# Altium schematic sheet YLT1.SchDoc
size A4
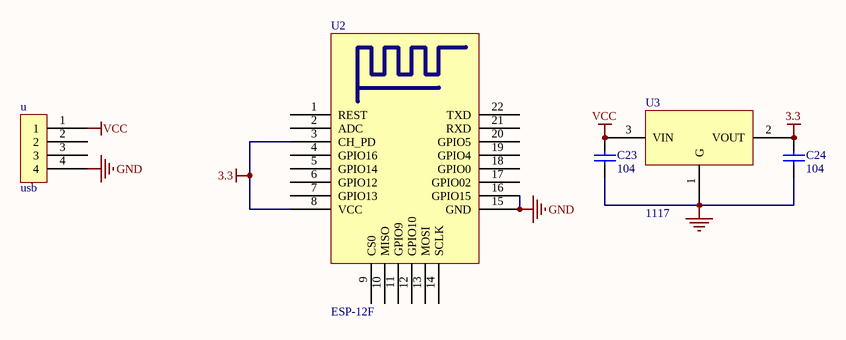
[diagram p0: YLT1.SchDoc]

## Parts
C23  value 104  [0603C]  (hidden comment: Cap)
C24  value 104  [0603C]  (hidden comment: Cap)
u  usb  [PCBComponent_1]
U2  ESP-12F  [LCC22_wifi]
U3  1117  [SOT223]

## Nets
3.3: C24.2 U2.3(CH_PD) U2.8(VCC) U3.2(VOUT)
GND: C23.1 C24.1 u.4 U2.15(GND) U2.16(GPIO15) U3.1(G)
VCC: C23.2 u.1 U3.3(VIN)

Not connected (* = marked no-connect by the designer): u 2 3; U2 1(REST) 2(ADC) 4(GPIO16) 5(GPIO14) 6(GPIO12) 7(GPIO13) 9(CS0) 10(MISO) 11(GPIO9) 12(GPIO10) 13(MOSI) 14(SCLK) 17(GPIO02) 18(GPIO0) 19(GPIO4) 20(GPIO5) 21(RXD) 22(TXD)

## Library data of the parts
C23 C24 = Cap: Capacitor; Published: 8-Jun-2000; LatestRevisionDate: 17-Jul-2002; LatestRevisionNote: Re-released for DXP Platform.; PackageReference: RAD-0.3; Publisher: Altium Limited
U3 = 117